# EAGLE schematic VCA-LM136700-Crossfader (EAGLE 7.2.0)
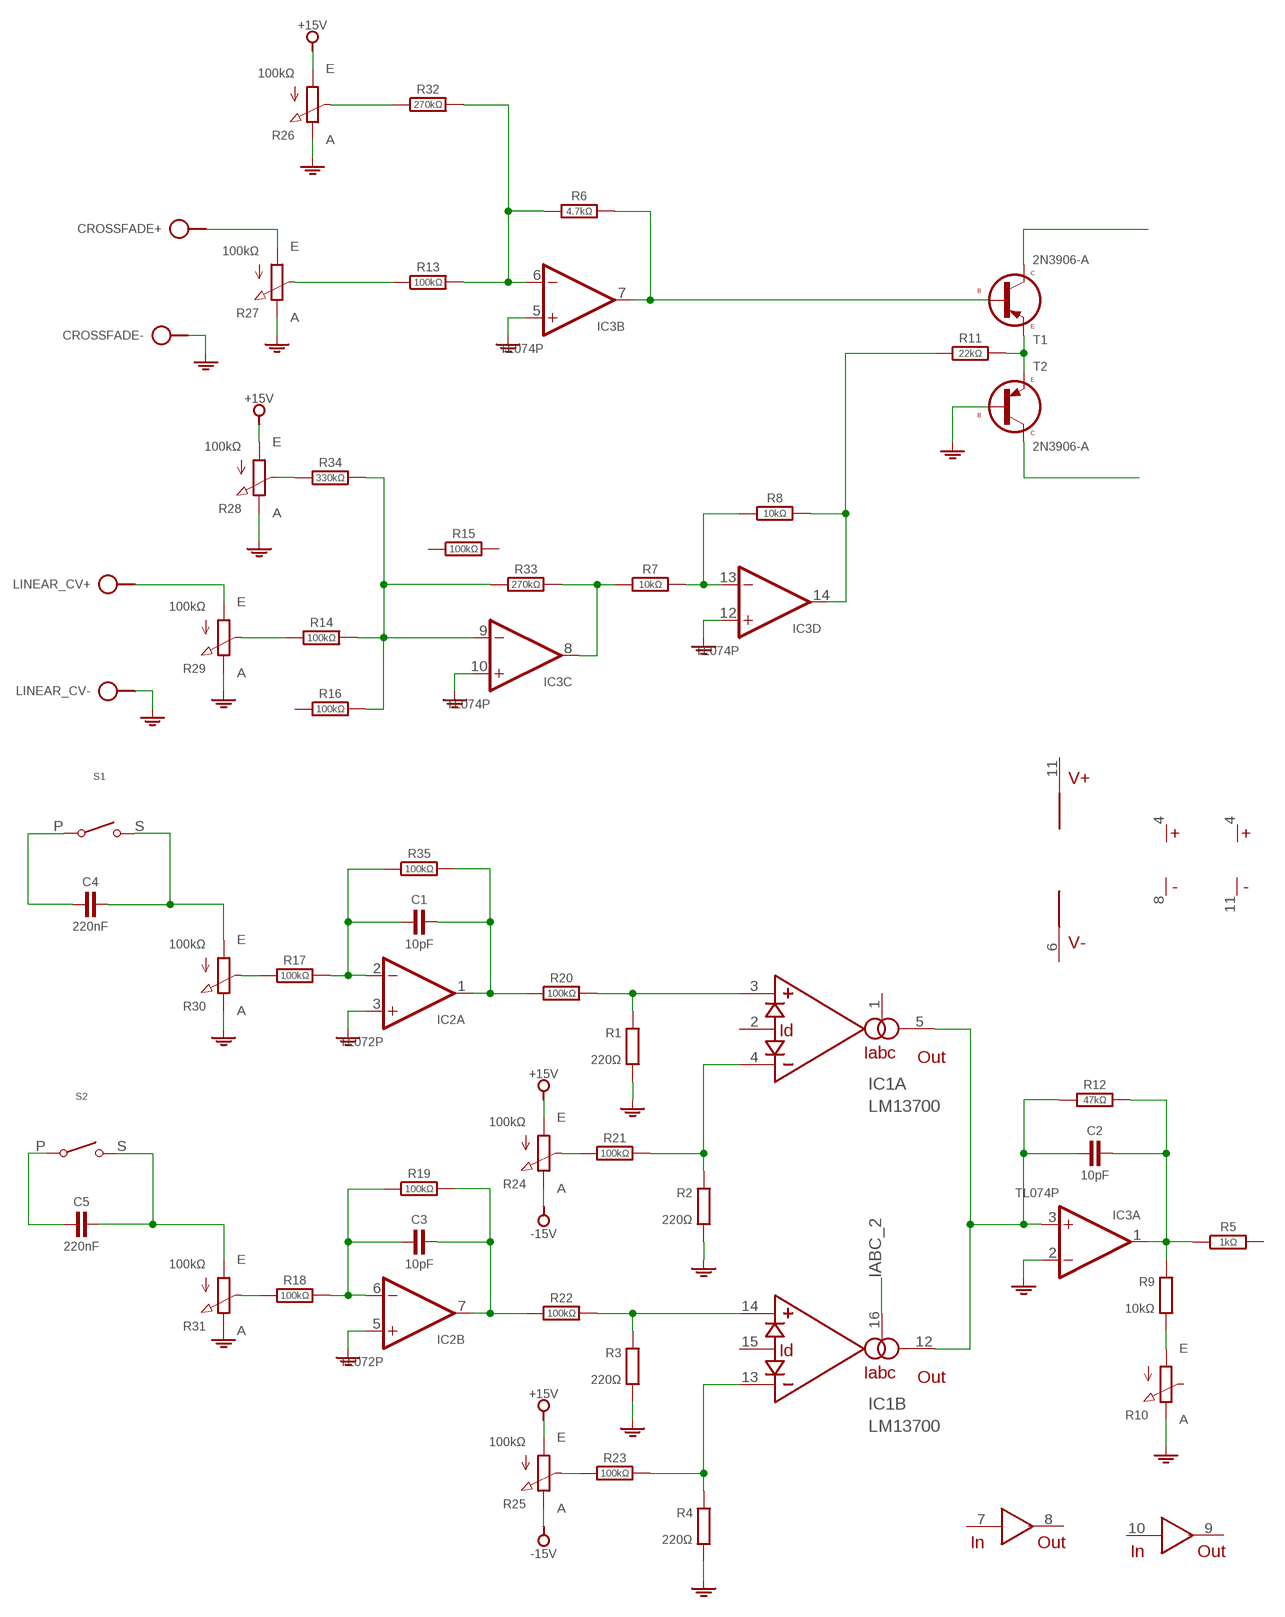
[diagram p0: schematic, sheet 1]

## Parts
C1  10pF  C-H025-015X024  [C025-015X024]
C2  10pF  C-H025-015X024  [C025-015X024]
C3  10pF  C-H025-015X024  [C025-015X024]
C4  220nF  C-H075-020X044  [C075-020X044]
C5  220nF  C-H075-020X044  [C075-020X044]
CROSSFADE  SPAD+-+-  [SPAD+-]
IC1  LM13700  [DIL16]
IC2  TL072P  [DIL08]
IC3  TL074P  [DIL14]
LINEAR_CV  SPAD+-+-  [SPAD+-]
R1  220Ω  R0204/10-V  [0204/10-V]
R2  220Ω  R0204/10-V  [0204/10-V]
R3  220Ω  R0204/10-V  [0204/10-V]
R4  220Ω  R0204/10-V  [0204/10-V]
R5  1kΩ  R-H0204/10  [0204/10]
R6  4.7kΩ  R-H0204/10  [0204/10]
R7  10kΩ  R-H0204/10  [0204/10]
R8  10kΩ  R-H0204/10  [0204/10]
R9  10kΩ  R0204/10-V  [0204/10-V]
R10  POT  [POT]
R11  22kΩ  R-H0204/10  [0204/10]
R12  47kΩ  R-H0204/10  [0204/10]
R13  100kΩ  R-H0204/10  [0204/10]
R14  100kΩ  R-H0204/10  [0204/10]
R15  100kΩ  R-H0204/10  [0204/10]
R16  100kΩ  R-H0204/10  [0204/10]
R17  100kΩ  R-H0204/10  [0204/10]
R18  100kΩ  R-H0204/10  [0204/10]
R19  100kΩ  R-H0204/10  [0204/10]
R20  100kΩ  R-H0204/10  [0204/10]
R21  100kΩ  R-H0204/10  [0204/10]
R22  100kΩ  R-H0204/10  [0204/10]
R23  100kΩ  R-H0204/10  [0204/10]
R24  100kΩ  POT-TRIM  [TRIM-POT]
R25  100kΩ  POT-TRIM  [TRIM-POT]
R26  100kΩ  POT  [POT]
R27  100kΩ  POT  [POT]
R28  100kΩ  POT  [POT]
R29  100kΩ  POT  [POT]
R30  100kΩ  POT  [POT]
R31  100kΩ  POT  [POT]
R32  270kΩ  R-H0204/10  [0204/10]
R33  270kΩ  R-H0204/10  [0204/10]
R34  330kΩ  R-H0204/10  [0204/10]
R35  100kΩ  R-H0204/10  [0204/10]
S1  SW-SPST-SL-1P2T  [SLSW-1P2T]
S2  SW-SPST-SL-1P2T  [SLSW-1P2T]
T1  2N3906-A  [TO92-EBC-A]
T2  2N3906-A  [TO92-EBC-A]

## Nets
+12V: R24.A R25.A R26.A R28.A ; supply symbol labelled +15V
-12V: R24.E R25.E ; supply symbol labelled -15V
GND: CROSSFADE.1 IC2.3(A:+IN) IC2.5(B:+IN) IC3.2(A:-IN) IC3.5(B:+IN) IC3.10(C:+IN) IC3.12(D:+IN) LINEAR_CV.1 R1.2 R2.2 R3.2 R4.2 R10.E R26.E R27.E R28.E R29.E R30.E R31.E T2.B
IABC_1: T1.C
IABC_2: IC1.16(IABC) T2.C
N$1: C2.2 IC3.1(A:OUT) R5.1 R9.1 R12.2
N$2: IC1.3(+IN) R1.1 R20.2
N$3: IC1.4(-IN) R2.1 R21.2
N$4: IC1.13(-IN) R4.1 R23.2
N$5: IC1.14(+IN) R3.1 R22.2
N$6: C1.1 IC2.2(A:-IN) R17.2 R35.1
N$7: C1.2 IC2.1(A:OUT) R20.1 R35.2
N$8: C3.1 IC2.6(B:-IN) R18.2 R19.1
N$9: C3.2 IC2.7(B:OUT) R19.2 R22.1
N$10: R9.2 R10.A
N$11: R11.2 T1.E T2.E
N$12: IC3.13(D:-IN) R7.2 R8.1
N$13: IC3.14(D:OUT) R8.2 R11.1
N$14: C2.1 IC1.5(OUT) IC1.12(OUT) IC3.3(A:+IN) R12.1
N$15: IC3.6(B:-IN) R6.1 R13.2 R32.2
N$16: IC3.9(C:-IN) R14.2 R16.2 R33.1 R34.2
N$17: IC3.7(B:OUT) R6.2 T1.B
N$18: IC3.8(C:OUT) R7.1 R33.2
N$19: R28.S R34.1
N$20: R14.1 R29.S
N$21: LINEAR_CV.2 R29.A
N$22: R26.S R32.1
N$23: R13.1 R27.S
N$24: CROSSFADE.2 R27.A
N$25: R17.1 R30.S
N$26: R18.1 R31.S
N$27: C4.2 R30.A S1.S
N$28: C4.1 S1.P
N$29: C5.2 R31.A S2.S
N$30: C5.1 S2.P
N$31: R21.1 R24.S
N$32: R23.1 R25.S
Unconnected: IC1.1(IABC) IC1.2(ID) IC1.6(V-) IC1.7(IN) IC1.8(OUT) IC1.9(OUT) IC1.10(IN) IC1.11(V+) IC1.15(ID) R5.2 R10.S R15.1 R15.2 R16.1

## Power pins joined to a net without a drawn wire
+15V: IC2.4(1:+15V) IC3.4(1:+15V)
-15V: IC2.8(1:-15V) IC3.11(1:-15V)

## Library data of the parts
C1-C5 = c:C-H
CROSSFADE LINEAR_CV = pad:SPAD+-
IC1 = ic:LM13700
IC2 = ic:TL072: Low-Noise JFET-Input Operational Amplifiers http://www.ti.com/lit/ds/symlink/tl072.pdf
IC3 = ic:TL074: Low-Noise JFET-Input Operational Amplifiers http://www.ti.com/lit/ds/symlink/tl072.pdf
R1-R4 R9 = r:R: RESISTOR, European symbol
R5-R8 R11-R23 R32-R35 = r:R-H
R10 R24-R31 = r:POT
S1 S2 = sw:SW-SPST
T1 T2 = t:2N3906